# Altium project SIUE_Analog_Multiplier.PrjPcb
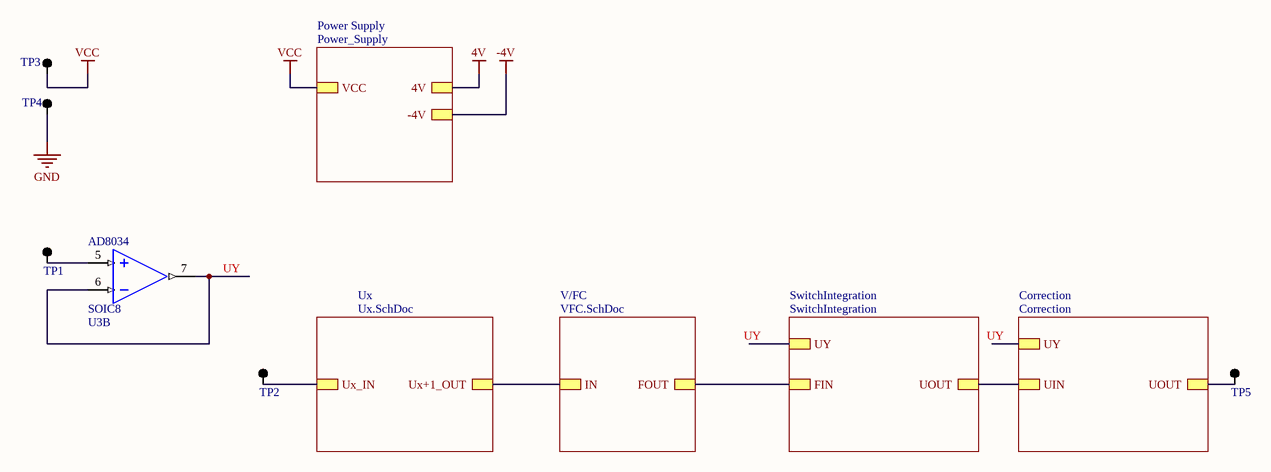
[diagram p0: Main.SchDoc]
Author: Daniel Borkowy, Jakub Płoskonka, Bartłomiej Smoter; Date: 10.11.2024r.; Revision: V1
5 sheets, 54 parts. Net scope: hierarchical (ports join the sheet entries above them; power ports are global).
Board file: PCB.PcbDoc
Sheets:
  Main.SchDoc
    Power Supply = Power_Supply.SchDoc
    V/FC = VFC.SchDoc
    Ux = Ux.SchDoc
    SwitchIntegration = SwitchIntegration.SchDoc

## Sheet Main.SchDoc
size A4; SheetNumber: 1; SheetTotal: 6

### Parts
TP1  Single pin  [TP_1PIN]  (value not drawn)  (no BOM)
TP2  Single pin  [TP_1PIN]  (value not drawn)  (no BOM)
TP3  Single pin  [TP_1PIN]  (value not drawn)  (no BOM)
TP4  Single pin  [TP_1PIN]  (value not drawn)  (no BOM)
TP5  Single pin  [TP_1PIN]  (value not drawn)  (no BOM)
U3  value AD8034  SCH_Footprint: SOIC8  [SO8]  (hidden comment: A2_AD8034)  (part B of 2)

### Sub-sheets
Correction = Correction (file not in this document): UIN, UOUT, UY
Power Supply = Power_Supply: VCC, 4V, -4V
SwitchIntegration = SwitchIntegration: FIN, UY, UOUT
Ux = Ux.SchDoc: Ux_IN, Ux+1_OUT
V/FC = VFC.SchDoc: FOUT, IN

### Nets
GND: TP4.1(TP)
VCC: TP3.1(TP) ; sheet Power Supply/VCC  [project net Vin]
UY: U3.6(IN-2) U3.7(OUT2) ; sheet SwitchIntegration/UY, sheet Correction/UY
NetC13_1: sheet SwitchIntegration/UOUT, sheet Correction/UIN
NetIC3_3: sheet V/FC/IN, sheet Ux/Ux+1_OUT
NetIC3_7: sheet V/FC/FOUT, sheet SwitchIntegration/FIN
NetTP1_1: TP1.1(TP) U3.5(IN+2)
NetTP2_1: TP2.1(TP) ; sheet Ux/Ux_IN
NetTP5_1: TP5.1(TP) ; sheet Correction/UOUT

### Notes on the sheet
- Name:
- Author:
- Project:
- Revision:
- Date:

### Library data of the parts
TP1-TP5 = TP_1PIN: Testpoint; Value: -; SCH_Footprint: Single; Part Number: TP_1PIN; HelpURL: -; Manufacturer: -; Manufacturer Part Number: -; Supplier 1: TME; Supplier 2: RS Components; Supplier 3: Farnell; Supplier 4: Mouser; Supplier 5: Digi-Key; Supplier 6: LCSC; Supplier 7: -; Supplier Part Number 7: -

## Sheet Power_Supply.SchDoc
size A4; SheetNumber: 2; SheetTotal: 6
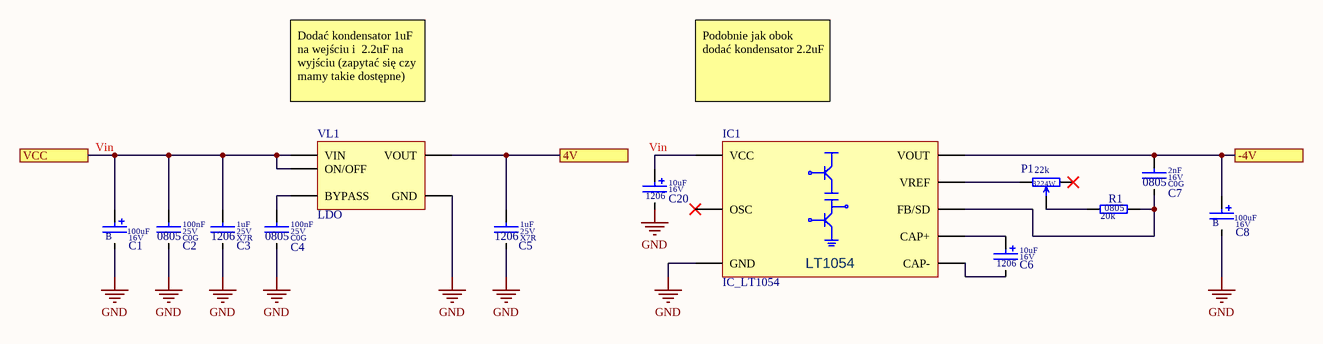
[diagram p1: Power_Supply.SchDoc]

### Parts
C1  value 100uF  SCH_Footprint: B  Voltage: 16V  [CT_B_CASE_BIG]  (hidden comment: CT_Taki_jak_da_Byczek_)
C2  value 100nF  Dielectric: C0G  Voltage: 25V  SCH_Footprint: 0805  [C_0805_2012]  (hidden comment: C_100nF_0805_C0G_25V_5)
C3  value 1uF  Dielectric: X7R  Voltage: 25V  SCH_Footprint: 1206  [C_1206_3216]  (hidden comment: C_1uF_1206_X7R_25V_5)
C4  value 100nF  Dielectric: C0G  Voltage: 25V  SCH_Footprint: 0805  [C_0805_2012]  (hidden comment: C_100nF_0805_C0G_25V_5)
C5  value 1uF  Dielectric: X7R  Voltage: 25V  SCH_Footprint: 1206  [C_1206_3216]  (hidden comment: C_2.2uF_1206_X7R_25V_5)
C6  value 10uF  SCH_Footprint: 1206  Voltage: 16V  [CT_1206_3216]  (hidden comment: CT_10uF_16V_1206_10)
C7  value 2nF  Dielectric: C0G  Voltage: 16V  SCH_Footprint: 0805  [C_0805_2012]  (hidden comment: C_2.2nF_0805_16V_C0G_5)
C8  value 100uF  SCH_Footprint: B  Voltage: 16V  [CT_B_CASE_BIG]  (hidden comment: CT_Taki_jak_da_Byczek_)
C20  value 10uF  SCH_Footprint: 1206  Voltage: 16V  [CT_1206_3216]  (hidden comment: CT_10uF_16V_1206_10)
IC1  IC_LT1054  [SOIC16]
P1  value 22k  SCH_Footprint: 3224W  [Potentiometer]
R1  SCH_Footprint: 0805  Resistance: 20k  [R_0805_2012]  (hidden comment: R_20k_0805_5)
VL1  LDO  [SOT23-5]

### Ports
4V, -4V, VCC

### Nets
4V: C5.1 VL1.5(VOUT) ; port 4V
-4V: C7.1 C8.1 IC1.11(VOUT) ; port -4V
GND: C1.2 C2.2 C3.2 C4.2 C5.2 C8.2 C20.2 IC1.5(GND) VL1.2(GND)
Vin: C1.1 C2.1 C3.1 C20.1 IC1.14(VCC) VL1.1(VIN) VL1.3(ON/OFF) ; port VCC
NetC4_1: C4.1 VL1.4(BYPASS)
NetC6_1: C6.1 IC1.4(CAP+)
NetC6_2: C6.2 IC1.6(CAP-)
NetC7_2: C7.2 IC1.3(FB/SD) R1.2
NetIC1_12: IC1.12(VREF) P1.3
NetP1_2: P1.2 R1.1

Not connected (* = marked no-connect by the designer): IC1 13(OSC)*; P1 1*

### Notes on the sheet
- Dodać kondensator 1uF na wejściu i  2.2uF na wyjściu (zapytać się czy mamy takie dostępne)
- Podobnie jak obok dodać kondensator 2.2uF
- (in symbol IC_LT1054) LT1054

### Library data of the parts
C1 C8 = CT_Taki_jak_da_Byczek_: Capacitor
C2 C4 = C_100nF_0805_C0G_25V_5: Capacitor
C3 = C_1uF_1206_X7R_25V_5: Capacitor
C5 = C_2.2uF_1206_X7R_25V_5: Capacitor
C6 C20 = CT_10uF_16V_1206_10: Capacitor
C7 = C_2.2nF_0805_16V_C0G_5: Capacitor
P1 = R
R1 = R_20k_0805_5: Tolerance: 5
VL1 = VL_LP2985IM5-4.0: Vout: 4V; Vin min: 2.5V; Vin max: 16V; Iout: 150mA; Vdrop: 250mV

## Sheet VFC.SchDoc
size A4; SheetNumber: 3; SheetTotal: 6
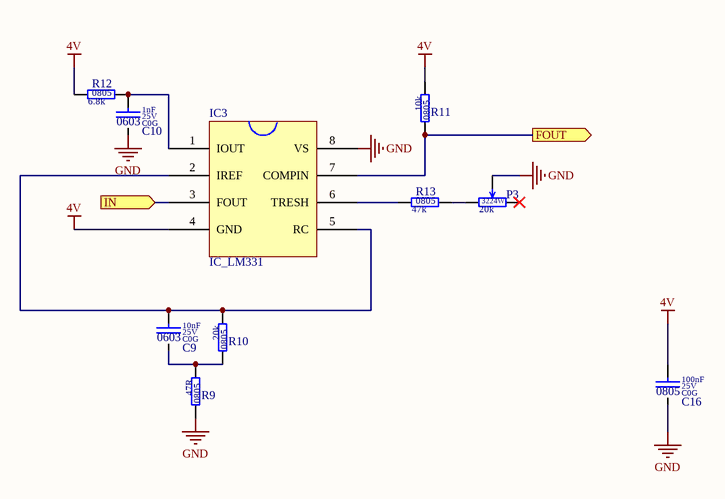
[diagram p2: VFC.SchDoc]

### Parts
C9  value 10nF  Dielectric: C0G  Voltage: 25V  SCH_Footprint: 0603  [C_0603_1608]  (hidden comment: C_10nF_0603_C0G_25V_5)
C10  value 1nF  Dielectric: C0G  Voltage: 25V  SCH_Footprint: 0603  [C_0603_1608]  (hidden comment: C_1nF_0603_C0G_25V_5)
C16  value 100nF  Dielectric: C0G  Voltage: 25V  SCH_Footprint: 0805  [C_0805_2012]  (hidden comment: C_100nF_0805_C0G_25V_5)
IC3  IC_LM331  [DIP8]
P3  value 20k  SCH_Footprint: 3224W  [Potentiometer]  (hidden comment: POT)
R9  SCH_Footprint: 0805  Resistance: 47R  [R_0805_2012]  (hidden comment: R_47R_0805_5)
R10  SCH_Footprint: 0805  Resistance: 20k  [R_0805_2012]  (hidden comment: R_22k_0805_5)
R11  SCH_Footprint: 0805  Resistance: 10k  [R_0805_2012]  (hidden comment: R_10k_0805_5)
R12  SCH_Footprint: 0805  Resistance: 6.8k  [R_0805_2012]  (hidden comment: R_6.8k_0805_5)
R13  SCH_Footprint: 0805  Resistance: 47k  [R_0805_2012]  (hidden comment: R_47k_0805_5)

### Ports
FOUT (out), IN (in)

### Nets
4V: C16.1 IC3.4(GND) R11.1 R12.1
GND: C10.2 C16.2 IC3.8(VS) P3.2 R9.2
NetC9_1: C9.1 IC3.2(IREF) IC3.5(RC) R10.1
NetC9_2: C9.2 R9.1 R10.2
NetC10_1: C10.1 IC3.1(IOUT) R12.2
NetIC3_3: IC3.3(FOUT) ; port IN
NetIC3_6: IC3.6(TRESH) R13.1
NetIC3_7: IC3.7(COMPIN) R11.2 ; port FOUT
NetP3_1: P3.1 R13.2

Not connected (* = marked no-connect by the designer): P3 3*

### Library data of the parts
C9 = C_10nF_0603_C0G_25V_5: Capacitor
C10 = C_1nF_0603_C0G_25V_5: Capacitor
C16 = C_100nF_0805_C0G_25V_5: Capacitor
R9 = R_47R_0805_5: Tolerance: 5
R10 = R_22k_0805_5: Tolerance: 5
R11 = R_10k_0805_5: Tolerance: 5
R12 = R_6.8k_0805_5: Tolerance: 5
R13 = R_47k_0805_5: Tolerance: 5

## Sheet Ux.SchDoc
size A4; SheetNumber: 4; SheetTotal: 6
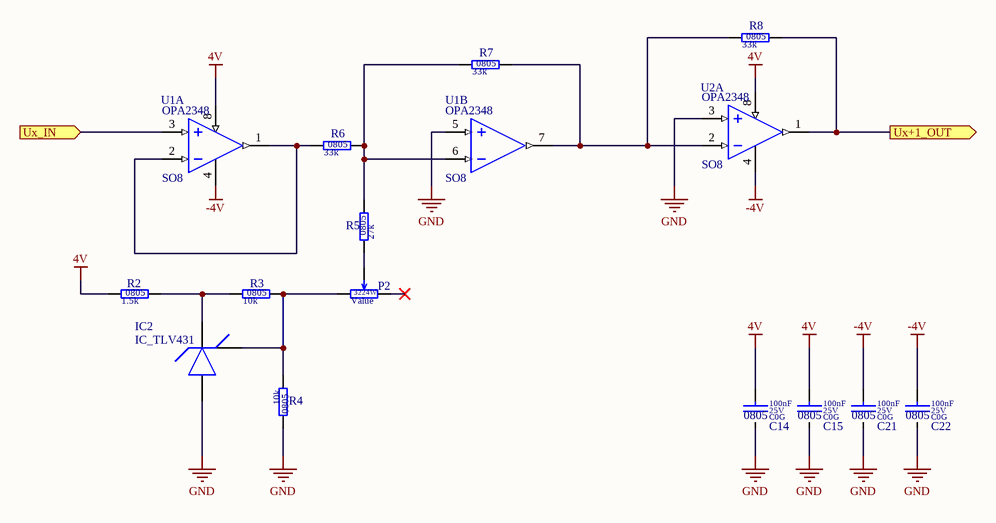
[diagram p3: Ux.SchDoc]

### Parts
C14  value 100nF  Dielectric: C0G  Voltage: 25V  SCH_Footprint: 0805  [C_0805_2012]  (hidden comment: C_100nF_0805_C0G_25V_5)
C15  value 100nF  Dielectric: C0G  Voltage: 25V  SCH_Footprint: 0805  [C_0805_2012]  (hidden comment: C_100nF_0805_C0G_25V_5)
C21  value 100nF  Dielectric: C0G  Voltage: 25V  SCH_Footprint: 0805  [C_0805_2012]  (hidden comment: C_100nF_0805_C0G_25V_5)
C22  value 100nF  Dielectric: C0G  Voltage: 25V  SCH_Footprint: 0805  [C_0805_2012]  (hidden comment: C_100nF_0805_C0G_25V_5)
IC2  IC_TLV431  [SOT23]
P2  SCH_Footprint: 3224W  [Potentiometer]  (hidden comment: POT)
R2  SCH_Footprint: 0805  Resistance: 1.5k  [R_0805_2012]  (hidden comment: R_1.5k_0805_5_1)
R3  SCH_Footprint: 0805  Resistance: 10k  [R_0805_2012]  (hidden comment: R_10k_0805_5)
R4  SCH_Footprint: 0805  Resistance: 10k  [R_0805_2012]  (hidden comment: R_10k_0805_5)
R5  SCH_Footprint: 0805  Resistance: 27k  [R_0805_2012]  (hidden comment: R_27k_0805_5)
R6  SCH_Footprint: 0805  Resistance: 33k  [R_0805_2012]  (hidden comment: R_33k_0805_5)
R7  SCH_Footprint: 0805  Resistance: 33k  [R_0805_2012]  (hidden comment: R_33k_0805_5)
R8  SCH_Footprint: 0805  Resistance: 33k  [R_0805_2012]  (hidden comment: R_33k_0805_5)
U1  value OPA2348  [SO8]  (hidden comment: A2_OPA2348)  (parts A,B of 2)
U2  value OPA2348  [SO8]  (hidden comment: A2_OPA2348)  (part A of 2)

### Ports
Ux+1_OUT (out), Ux_IN (in)

### Nets
4V: C14.1 C15.1 R2.1 U1.8(VDD) U2.8(VDD)
-4V: C21.1 C22.1 U1.4(GND) U2.4(GND)
GND: C14.2 C15.2 C21.2 C22.2 IC2.3(ANODE) R4.2 U1.5(IN+2) U2.3(IN+1)
NetIC2_1: IC2.1(REF) P2.1 R3.2 R4.1
NetIC2_2: IC2.2(CATH) R2.2 R3.1
NetIC3_3: R8.2 U2.1(OUT1) ; port Ux+1_OUT
NetP2_2: P2.2 R5.1
NetR5_2: R5.2 R6.2 R7.1 U1.6(IN-2)
NetR6_1: R6.1 U1.1(OUT1) U1.2(IN-1)
NetR7_2: R7.2 R8.1 U1.7(OUT2) U2.2(IN-1)
NetTP2_1: U1.3(IN+1) ; port Ux_IN

Not connected (* = marked no-connect by the designer): P2 3*

### Library data of the parts
C14 C15 C21 C22 = C_100nF_0805_C0G_25V_5: Capacitor
R2 = R_1.5k_0805_5_1: Tolerance: 5
R3 R4 = R_10k_0805_5: Tolerance: 5
R5 = R_27k_0805_5: Tolerance: 5
R6-R8 = R_33k_0805_5: Tolerance: 5
P2 = POT: Value: Value
U1 U2 = A2_OPA2348: SCH_Footprint: SO8

## Sheet SwitchIntegration.SchDoc
size A4; SheetNumber: 5; SheetTotal: 6
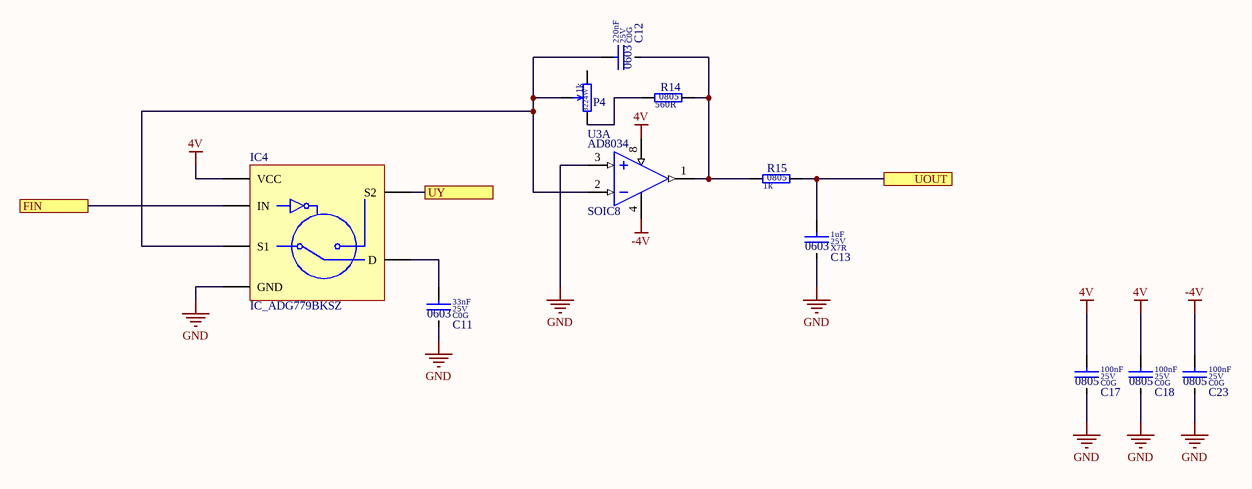
[diagram p4: SwitchIntegration.SchDoc]

### Parts
C11  value 33nF  Dielectric: C0G  Voltage: 25V  SCH_Footprint: 0603  [C_0603_1608]  (hidden comment: C_33nF_0603_C0G_25V_5)
C12  value 220nF  Dielectric: C0G  Voltage: 25V  SCH_Footprint: 0603  [C_0603_1608]  (hidden comment: C_220nF_0603_C0G_25V_5)
C13  value 1uF  Dielectric: X7R  Voltage: 25V  SCH_Footprint: 0603  [C_1206_3216]  (hidden comment: C_1uF_1206_X7R_25V_5)
C17  value 100nF  Dielectric: C0G  Voltage: 25V  SCH_Footprint: 0805  [C_0805_2012]  (hidden comment: C_100nF_0805_C0G_25V_5)
C18  value 100nF  Dielectric: C0G  Voltage: 25V  SCH_Footprint: 0805  [C_0805_2012]  (hidden comment: C_100nF_0805_C0G_25V_5)
C23  value 100nF  Dielectric: C0G  Voltage: 25V  SCH_Footprint: 0805  [C_0805_2012]  (hidden comment: C_100nF_0805_C0G_25V_5)
IC4  IC_ADG779BKSZ  [SC70]
P4  value 1k  SCH_Footprint: 3224W  [Potentiometer]  (hidden comment: POT_1k)
R14  SCH_Footprint: 0805  Resistance: 560R  [R_0805_2012]  (hidden comment: R_560R_0805_5)
R15  SCH_Footprint: 0805  Resistance: 1k  [R_0805_2012]  (hidden comment: R_1k_0805_5)
U3  value AD8034  SCH_Footprint: SOIC8  [SO8]  (hidden comment: A2_AD8034)  (part A of 2)

### Ports
FIN, UOUT, UY

### Nets
4V: C17.1 C18.1 IC4.2(VCC) U3.8(VDD)
-4V: C23.1 U3.4(GND)
GND: C11.2 C13.2 C17.2 C18.2 C23.2 IC4.3(GND) U3.3(IN+1)
UY: IC4.6(S2) ; port UY
NetC11_1: C11.1 IC4.5(D)
NetC12_1: C12.1 IC4.4(S1) P4.2 U3.2(IN-1)
NetC12_2: C12.2 R14.2 R15.1 U3.1(OUT1)
NetC13_1: C13.1 R15.2 ; port UOUT
NetIC3_7: IC4.1(IN) ; port FIN
NetP4_3: P4.3 R14.1

Not connected (* = marked no-connect by the designer): P4 1

### Library data of the parts
C11 = C_33nF_0603_C0G_25V_5: Capacitor
C12 = C_220nF_0603_C0G_25V_5: Capacitor
C13 = C_1uF_1206_X7R_25V_5: Capacitor
C17 C18 C23 = C_100nF_0805_C0G_25V_5: Capacitor
R14 = R_560R_0805_5: Tolerance: 5
R15 = R_1k_0805_5: Tolerance: 5

## Nets that join several sheets
4V: Power_Supply (C5.1 VL1.5), VFC (C16.1 IC3.4 R11.1 R12.1), Ux (5 pins), SwitchIntegration (C17.1 C18.1 IC4.2 U3.8)
-4V: Power_Supply (C7.1 C8.1 IC1.11), Ux (C21.1 C22.1 U1.4 U2.4), SwitchIntegration (C23.1 U3.4)
GND: Main (TP4.1), Power_Supply (9 pins), VFC (5 pins), Ux (8 pins), SwitchIntegration (7 pins)
Vin: Main (TP3.1), Power_Supply (7 pins)
NetIC3_3: VFC (IC3.3), Ux (R8.2 U2.1)
NetIC3_7: VFC (IC3.7 R11.2), SwitchIntegration (IC4.1)
NetTP2_1: Main (TP2.1), Ux (U1.3)
UY: Main (U3.6 U3.7), SwitchIntegration (IC4.6)